# Altium schematic sheet LedLogic.SchDoc
size A4
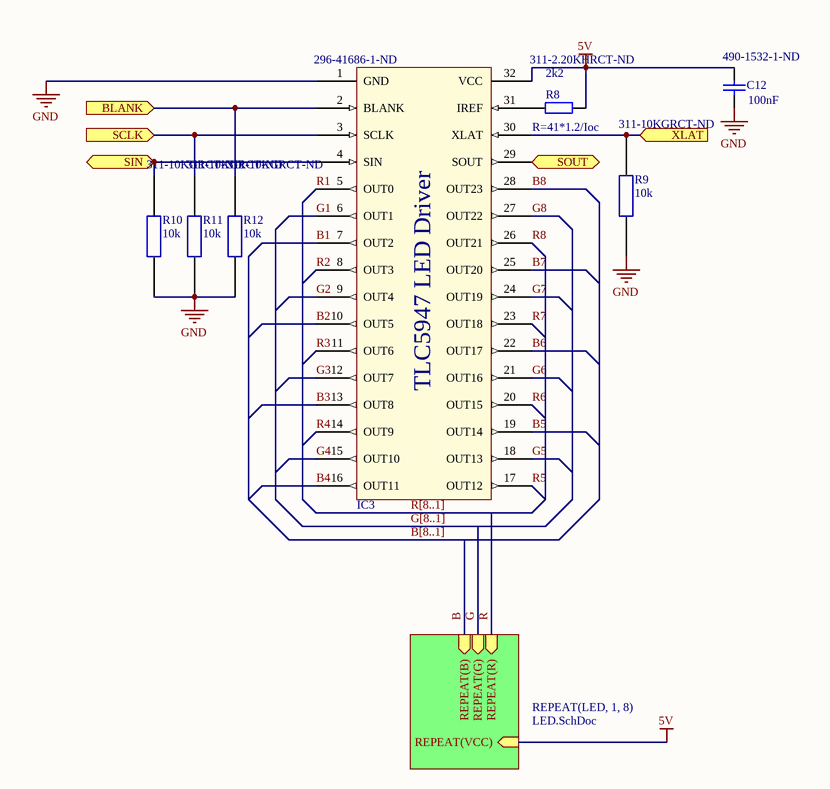
[diagram p0: LedLogic.SchDoc]

## Parts
C12  value 100nF  Supplier Part Number 1: 490-1532-1-ND  [Res 0603]  (hidden comment: Cap)
IC3  Supplier Part Number 1: 296-41686-1-ND  [TSOP 32Pin]  (hidden comment: TLC5947 LED Driver)
R8  value 2k2  Supplier Part Number 1: 311-2.20KHRCT-ND  [Res 0603]  (hidden comment: Res2)
R9  10k  Supplier Part Number 1: 311-10KGRCT-ND  [Res 0603]
R10  10k  Supplier Part Number 1: 311-10KGRCT-ND  [Res 0603]
R11  10k  Supplier Part Number 1: 311-10KGRCT-ND  [Res 0603]
R12  10k  Supplier Part Number 1: 311-10KGRCT-ND  [Res 0603]

## Sub-sheets
REPEAT(LED, 1, 8) = LED.SchDoc: REPEAT(R) (in), REPEAT(G) (in), REPEAT(B) (in), REPEAT(VCC) (in)

## Ports
BLANK (in), SCLK (in), SIN (in), SOUT (out), XLAT (in)

## Nets
5V: C12.2 IC3.32(VCC) R8.2 ; sheet REPEAT(LED, 1, 8)/REPEAT(VCC)
GND: C12.1 IC3.1(GND) R9.2 R10.2 R11.2 R12.2
B: sheet REPEAT(LED, 1, 8)/REPEAT(B)
B1: IC3.7(OUT2)
B2: IC3.10(OUT5)
B3: IC3.13(OUT8)
B4: IC3.16(OUT11)
B5: IC3.19(OUT14)
B6: IC3.22(OUT17)
B7: IC3.25(OUT20)
B8: IC3.28(OUT23)
BLANK: IC3.2(BLANK) R12.1 ; port BLANK
G: sheet REPEAT(LED, 1, 8)/REPEAT(G)
G1: IC3.6(OUT1)
G2: IC3.9(OUT4)
G3: IC3.12(OUT7)
G4: IC3.15(OUT10)
G5: IC3.18(OUT13)
G6: IC3.21(OUT16)
G7: IC3.24(OUT19)
G8: IC3.27(OUT22)
R: sheet REPEAT(LED, 1, 8)/REPEAT(R)
R1: IC3.5(OUT0)
R2: IC3.8(OUT3)
R3: IC3.11(OUT6)
R4: IC3.14(OUT9)
R5: IC3.17(OUT12)
R6: IC3.20(OUT15)
R7: IC3.23(OUT18)
R8: IC3.26(OUT21)
SCLK: IC3.3(SCLK) R11.1 ; port SCLK
SIN: IC3.4(SIN) R10.1 ; port SIN
SOUT: IC3.29(SOUT) ; port SOUT
XLAT: IC3.30(XLAT) R9.1 ; port XLAT
NetIC3_31: IC3.31(IREF) R8.1

## Buses and harness runs
bus B[8..1]
bus G[8..1]
bus R[8..1]

## Notes on the sheet
- (near R8) R=41*1.2/Ioc

## Library data of the parts
C12 = Cap: Capacitor; Published: 8-Jun-2000; LatestRevisionDate: 17-Jul-2002; LatestRevisionNote: Re-released for DXP Platform.; PackageReference: RAD-0.3; Publisher: Altium Limited; PackageDescription: Radial Cap, Thru-Hole; 2 Leads; 0.3 in Pin Spacing; Supplier 1: Digi-Key
R8 = Res2: Resistor; Published: 8-Jun-2000; LatestRevisionDate: 17-Jul-2002; LatestRevisionNote: Re-released for DXP Platform.; PackageReference: AXIAL-0.4; Publisher: Altium Limited; PackageDescription: Axial Device, Thru-Hole; 2 Leads; 0.4 in Pin Spacing; Supplier 1: Digi-Key
R9-R12 = Res: Value: 10k; Supplier 1: Digi-Key
IC3 = TLC5947 LED Driver: Supplier 1: Digi-Key